# Altium schematic sheet 幻影光靈-學院-武器_20241004.SchDoc
size A3
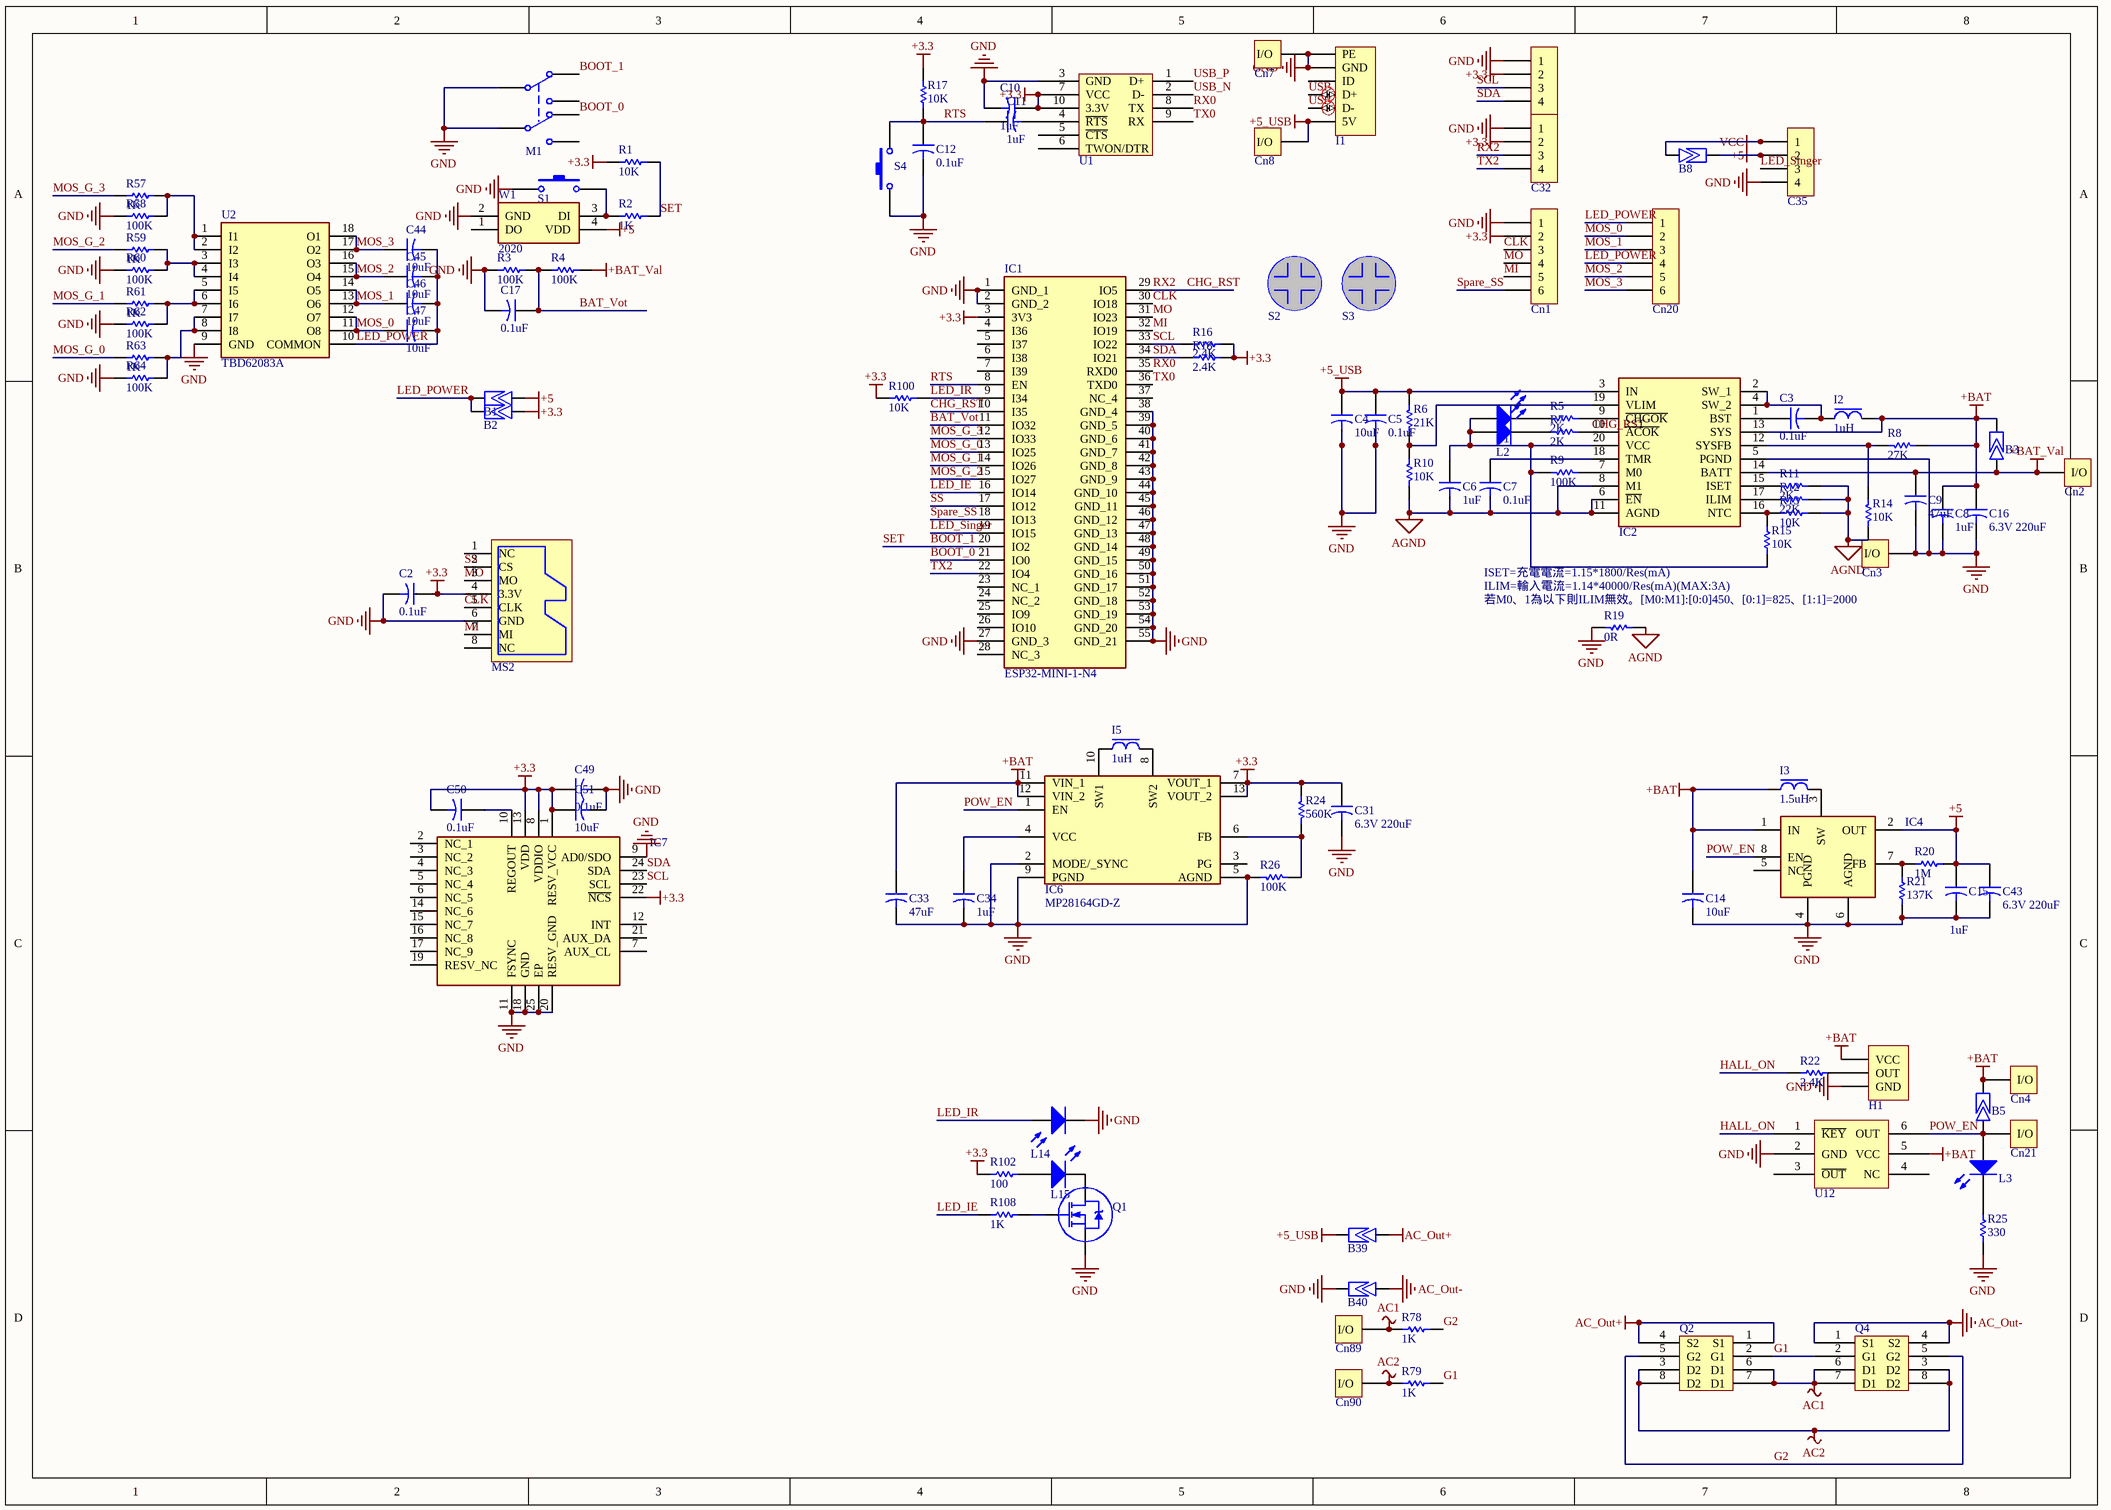
[diagram p0: 幻影光靈-學院-武器_20241004.SchDoc]

## Parts
B1  不短路  [BYPASS-0805]  (value not drawn)
B2  短路  [BYPASS-0805]  (value not drawn)
B3  不短路  [BYPASS-0805]  (value not drawn)
B5  短路  [BYPASS-0402]  (value not drawn)
B8  短路  [BYPASS-0805]  (value not drawn)
B39  短路  [BYPASS-1206]  (value not drawn)
B40  短路  [BYPASS-1206]  (value not drawn)
C1  KF2510-4  [Connector_KF2510-4A]  (value not drawn)
C2  0.1uF  [Cap-0603]
C3  0.1uF  [Cap-0603]
C4  10uF  [Cap-0603]
C5  0.1uF  [Cap-0603]
C6  1uF  [Cap-0603]
C7  0.1uF  [Cap-0603]
C8  1uF  [Cap-0603]
C9  47uF  [CAP-1210]
C10  1uF  [Cap-0603]
C11  1uF  [Cap-0603]
C12  0.1uF  [Cap-0603]
C14  10uF  [Cap-0603]
C15  1uF  [Cap-0603]
C16  6.3V 220uF  [CAP-B3528]
C17  0.1uF  [Cap-0603]
C31  6.3V 220uF  [CAP-B3528]
C32  KF2510-4  [Connector_KF2510-4A]  (value not drawn)
C33  47uF  [Cap-0603]
C34  1uF  [Cap-0603]
C35  KF2510-4  [Connector_KF2510-4A]  (value not drawn)
C43  6.3V 220uF  [CAP-B3528]
C44  10uF  [Cap-0603]
C45  10uF  [Cap-0603]
C46  10uF  [Cap-0603]
C47  10uF  [Cap-0603]
C49  0.1uF  [Cap-0603]
C50  0.1uF  [Cap-0603]
C51  10uF  [Cap-0603]
Cn1  KF2510-6  [Connector_KF2510-6A]  (value not drawn)
Cn2  Contact  [Contact_Joints1*0.5]  (value not drawn)
Cn3  Contact  [Contact_Joints1*0.5]  (value not drawn)
Cn4  Contact  [Contact_Joints1*0.5]  (value not drawn)
Cn7  Contact  [Contact_Joints1*0.5]  (value not drawn)
Cn8  Contact  [Contact_Joints1*0.5]  (value not drawn)
Cn20  KF2510-6  [Connector_KF2510-6A]  (value not drawn)
Cn21  Contact  [Contact_Joints1*0.5]  (value not drawn)
Cn89  Contact  [Contact_Joints1*0.5]  (value not drawn)
Cn90  Contact  [Contact_Joints1*0.5]  (value not drawn)
H1  A3212#不用SMT  [SOT 23-3]  (value not drawn)
I1  Interface_USB-Micro  [Interface_USB-micro]  (value not drawn)
I2  1uH  [Inductor-0630]
I3  1.5uH  [Inductor-0630]
I5  1uH  [Inductor-0630]
IC1  ESP32-MINI-1-N4  [ESP32MINI1N4]
IC2  MP2617BGL-P  [MP2617BGL]  (value not drawn)
IC4  MP3414AGJ-Z  [SOT 23-8]  (value not drawn)
IC6  MP28164GD-Z  [MP28164GDZ]
IC7  MPU-9250  [QFN-24]  (value not drawn)
L1  紅  [LED-0603]  (value not drawn)
L2  綠  [LED-0603]  (value not drawn)
L3  綠  [LED-0603]  (value not drawn)
L14  LED-IR  [LED-IR-1206]  (value not drawn)
L15  LED-IE  [LED-IE-1206]  (value not drawn)
M1  MST22D18G2  [Switch_MST22D18G2]  (value not drawn)
MS2  Interface_MicroSD card slot  [Interface_MicroSD card slot]  (value not drawn)
Q1  AO3400  [SOT 23-3]  (value not drawn)
Q2  MOS_Dual P_AON2801  [DFN-6_2x2]  (value not drawn)
Q4  MOS_Dual N_AON2800  [DFN-6_2x2]  (value not drawn)
R1  10K  [Res-0603]
R2  1K  [Res-0603]
R3  100K  [Res-0603]
R4  100K  [Res-0603]
R5  2K  [Res-0603]
R6  21K  [Res-0603]
R7  2K  [Res-0603]
R8  27K  [Res-0603]
R9  100K  [Res-0603]
R10  10K  [Res-0603]
R11  2K  [Res-0603]
R12  22K  [Res-0603]
R13  10K  [Res-0603]
R14  10K  [Res-0603]
R15  10K  [Res-0603]
R16  2.4K  [Res-0603]
R17  10K  [Res-0603]
R18  2.4K  [Res-0603]
R19  0R  [Res-0603]
R20  1M  [Res-0603]
R21  137K  [Res-0603]
R22  2.4K  [Res-0603]
R24  560K  [Res-0603]
R25  330  [Res-0603]
R26  100K  [Res-0603]
R57  1K  [Res-0603]
R58  100K  [Res-0603]
R59  1K  [Res-0603]
R60  100K  [Res-0603]
R61  1K  [Res-0603]
R62  100K  [Res-0603]
R63  1K  [Res-0603]
R64  100K  [Res-0603]
R78  1K  [Res-0603]
R79  1K  [Res-0603]
R100  10K  [Res-0603]
R102  100  [Res-0603]
R108  1K  [Res-0603]
S1  Switch  [Switch SMD-3.6*6*2.5]  (value not drawn)
S2  M3  [Screw M3]  (value not drawn)
S3  M3  [Screw M3]  (value not drawn)
S4  Switch  [Switch SMD-3.6*6*2.5]  (value not drawn)
U1  CH340X  [SSOP-10]  (value not drawn)
U2  TBD62083A  [TSSOP-18]
U12  CS2130#不用SMT  [SOT 23-6]  (value not drawn)
W1  2020  [LED-WS2812B-2020]

## Nets
+3.3: B2.2 C1.2 C2.1 C10.1 C31.1 C32.2 C49.1 C50.2 C51.1 Cn1.2 IC1.3(3V3) IC6.7(VOUT_1) IC6.13(VOUT_2) IC7.1(RESV_VCC) IC7.8(VDDIO) IC7.13(VDD) IC7.22(~{NCS}) MS2.4(3.3V) R1.1 R16.1 R17.1 R18.2 R24.2 R100.1 R102.1 U1.7(VCC) U1.10(3.3V)
+5: B1.2 B8.1 C15.1 C35.2 C43.1 IC4.2(OUT) R20.1 W1.4(VDD)
+5_USB: B39.1 C4.1 C5.1 Cn8.1(I/O) I1.1(5V) IC2.3(IN) R6.1
+BAT: B3.1 B5.1 C8.1 C14.1 C16.1 C33.1 Cn4.1(I/O) H1.1(VCC) I2.2 I3.1 IC2.13(SYS) IC4.1(IN) IC6.11(VIN_1) IC6.12(VIN_2) R8.2 U12.5(VCC)
+BAT_Val: B3.2 C9.1 Cn2.1(I/O) IC2.14(BATT) R4.2
AC1: Cn89.1(I/O) Q2.6(D1) Q2.7(D1) Q4.6(D1) Q4.7(D1) R78.2
AC2: Cn90.1(I/O) Q2.3(D2) Q2.8(D2) Q4.3(D2) Q4.8(D2) R79.2
AC_Out+: B39.2 Q2.1(S1) Q2.4(S2)
AC_Out-: B40.2 Q4.1(S1) Q4.4(S2)
AGND: C6.2 C7.2 IC2.6(~{EN}) IC2.8(M1) IC2.11(AGND) R10.2 R11.2 R12.2 R13.2 R14.2 R19.2
GND: B40.1 C1.1 C2.2 C4.2 C5.2 C8.2 C9.2 C10.2 C12.2 C14.2 C15.2 C16.2 C17.2 C31.2 C32.1 C33.2 C34.2 C35.4 C43.2 C49.2 C51.2 Cn1.1 Cn3.1(I/O) Cn7.1(I/O) H1.3(GND) I1.5(GND) I1.PE IC1.1(GND_1) IC1.2(GND_2) IC1.27(GND_3) IC1.38(GND_4) IC1.39(GND_5) IC1.40(GND_6) IC1.41(GND_7) IC1.42(GND_8) IC1.43(GND_9) IC1.44(GND_10) IC1.45(GND_11) IC1.46(GND_12) IC1.47(GND_13) IC1.48(GND_14) IC1.49(GND_15) IC1.50(GND_16) IC1.51(GND_17) IC1.52(GND_18) IC1.53(GND_19) IC1.54(GND_20) IC1.55(GND_21) IC2.5(PGND) IC4.4(PGND) IC4.6(AGND) IC6.2(MODE/_SYNC) IC6.5(AGND) IC6.9(PGND) IC7.9(AD0/SDO) IC7.11(FSYNC) IC7.18(GND) IC7.20(RESV_GND) IC7.25(EP) L14.2(K) M1.1 M1.4 MS2.6(GND) Q1.2(S) R3.1 R19.1 R21.1 R25.1 R26.1 R58.1 R60.1 R62.1 R64.1 S1.1 S4.2 U1.3(GND) U2.9(GND) U12.2(GND) W1.2(GND)
VCC: B8.2 C35.1
BAT_Vot: C17.1 IC1.11(IO32) R3.2 R4.1
BOOT_0: IC1.21(IO0) M1.5
BOOT_1: IC1.20(IO2) M1.2 R1.2 R2.2  [also labelled SET]
CHG_RST: C32.3 IC1.10(I35) IC1.29(IO5) IC2.10(~{ACOK}) R7.2  [also labelled RX2]
CLK: Cn1.3 IC1.30(IO18) MS2.5(CLK)
G1: Q2.2(G1) Q4.2(G1) R79.1
G2: Q2.5(G2) Q4.5(G2) R78.1
HALL_ON: R22.1 U12.1(~{KEY})
LED_IE: IC1.16(IO14) R108.1
LED_IR: IC1.9(I34) L14.1(A) R100.2
LED_POWER: B1.1 B2.1 C44.2 C45.2 C46.2 C47.2 Cn20.1 Cn20.4 U2.10(COMMON)
LED_Singer: C35.3 IC1.19(IO15)
MI: Cn1.5 IC1.32(IO19) MS2.7(MI)
MO: Cn1.4 IC1.31(IO23) MS2.3(MO)
MOS_0: C47.1 Cn20.2 U2.11(O8) U2.12(O7)
MOS_1: C46.1 Cn20.3 U2.13(O6) U2.14(O5)
MOS_2: C45.1 Cn20.5 U2.15(O4) U2.16(O3)
MOS_3: C44.1 Cn20.6 U2.17(O2) U2.18(O1)
MOS_G_0: IC1.13(IO25) R63.1
MOS_G_1: IC1.14(IO26) R61.1
MOS_G_2: IC1.15(IO27) R59.1
MOS_G_3: IC1.12(IO33) R57.1
POW_EN: B5.2 Cn21.1(I/O) IC4.8(EN) IC6.1(EN) L3.2(A) U12.6(OUT)
RTS: C11.1 C12.1 IC1.8(EN) R17.2 S4.1
RX0: IC1.35(RXD0) U1.8(TX)
SCL: C1.3 IC1.33(IO22) IC7.23(SCL) R16.2
SDA: C1.4 IC1.34(IO21) IC7.24(SDA) R18.1
Spare_SS: Cn1.6 IC1.18(IO13)
SS: IC1.17(IO12) MS2.2(CS)
TX0: IC1.36(TXD0) U1.9(RX)
TX2: C32.4 IC1.22(IO4)
USB_N: I1.2(D-) U1.2(D-)
USB_P: I1.3(D+) U1.1(D+)
NetC3_1: C3.1 IC2.1(BST)
NetC3_2: C3.2 I2.1 IC2.2(SW_1) IC2.4(SW_2)
NetC6_1: C6.1 IC2.20(VCC) L1.2(A) L2.2(A) R9.1 R15.1
NetC7_1: C7.1 IC2.18(TMR)
NetC11_2: C11.2 U1.4(~{RTS})
NetC34_1: C34.1 IC6.4(VCC)
NetC50_1: C50.1 IC7.10(REGOUT)
NetH1_2: H1.2(OUT) R22.2
NetI3_2: I3.2 IC4.3(SW)
NetI5_1: I5.1 IC6.8(SW2)
NetI5_2: I5.2 IC6.10(SW1)
NetIC2_7: IC2.7(M0) R9.2
NetIC2_9: IC2.9(~{CHGOK}) R5.2
NetIC2_12: IC2.12(SYSFB) R8.1 R14.1
NetIC2_15: IC2.15(ISET) R11.1
NetIC2_16: IC2.16(NTC) R13.1 R15.2
NetIC2_17: IC2.17(ILIM) R12.1
NetIC2_19: IC2.19(VLIM) R6.2 R10.1
NetIC4_7: IC4.7(FB) R20.2 R21.2
NetIC6_6: IC6.6(FB) R24.1 R26.2
NetL1_1: L1.1(K) R5.1
NetL2_1: L2.1(K) R7.1
NetL3_1: L3.1(K) R25.2
NetL15_1: L15.1(K) Q1.3(D)
NetL15_2: L15.2(A) R102.2
NetQ1_1: Q1.1(G) R108.2
NetR2_1: R2.1 S1.2 W1.3(DI)
NetR57_2: R57.2 R58.2 U2.1(I1) U2.2(I2)
NetR59_2: R59.2 R60.2 U2.3(I3) U2.4(I4)
NetR61_2: R61.2 R62.2 U2.5(I5) U2.6(I6)
NetR63_2: R63.2 R64.2 U2.7(I7) U2.8(I8)

Not connected (* = marked no-connect by the designer): I1 4(ID); IC1 4(I36) 5(I37) 6(I38) 7(I39) 23(NC_1) 24(NC_2) 25(IO9) 26(IO10) 28(NC_3) 37(NC_4); IC4 5(NC); IC6 3(PG); IC7 2(NC_1) 3(NC_2) 4(NC_3) 5(NC_4) 6(NC_5) 7(AUX_CL) 12(INT) 14(NC_6) 15(NC_7) 16(NC_8) 17(NC_9) 19(RESV_NC) 21(AUX_DA); M1 3 6; MS2 1(NC) 8(NC); U1 5(~{CTS}) 6(TWON/DTR); U12 3(~{OUT}) 4(NC); W1 1(DO)

## Layout directives
differential pair: USB_N, USB_P

## Notes on the sheet
- ISET=充電電流=1.15*1800/Res(mA)
- (near R19) ILIM=輸入電流=1.14*40000/Res(mA)(MAX:3A)
- (near R19) 若M0、1為以下則ILIM無效。[M0:M1]:[0:0]450、[0:1]=825、[1:1]=2000

## Library data of the parts
B1-B3 B5 B8 B39 B40 = Bypass: 短路焊點(如標註短路則需額外補錫使其短路)
C1 C32 C35 = Contact(4P): 接線端子
C2-C12 C14-C17 C31 C33 C34 C43-C47 C49-C51 = Cap: 電容
  C9 C16 C17 C31 C43-C47 C49-C51: ComponentLink1Description: datasheet; ComponentLink1URL: https://product.tdk.com/system/files/dam/doc/product/capacitor/ceramic/mlcc/catalog/mlcc_commercial_general_en.pdf
  C14: ComponentLink1Description: datasheet; ComponentLink1URL: chrome-extension://efaidnbmnnnibpcajpcglclefindmkaj/https://product.tdk.com/system/files/dam/doc/product/capacitor/ceramic/mlcc/catalog/mlcc_commercial_general_en.pdf
Cn1 Cn20 = Contact(6P): 接線端子
Cn2-Cn4 Cn7 Cn8 Cn21 Cn89 Cn90 = Contact: 接線端子、接點、郵票孔(非焊接元件)
H1 = Sensor_Hall: 感測器_霍爾
I1 = Interface_USB-Micro: 接頭_USB-Micro
I2 I3 = Inductor: 電感
I5 = Inductor: 一體成型電感
IC1 = ESP32-MINI-1-N4: Integrated Circuit; Manufacturer_Name: Espressif Systems; Datasheet Link: https://www.mouser.ca/datasheet/2/891/Espressif_Systems_04082021_ESP32_MINI_1-2295906.pdf; Height: 2.55mm; Manufacturer_Part_Number: ESP32-MINI-1-N4; Mouser Part Number: 356-ESP32-MINI1PH3Q0; Mouser Price/Stock: https://www.mouser.co.uk/ProductDetail/Espressif-Systems/ESP32-MINI-1-N4?qs=DRkmTr78QAQ4lzAXUvxJJw%3D%3D
IC2 = MP2617BGL-P: 單節鋰電池管理IC / M0:0、M1:0=輸入限流500ma / M0:0、M1:1=輸入限流900ma / M0:1、M1:0=根據ILIM / M0:NC、M1:NC=輸入限流2A / ILIM公式=1.14*40000/R，23K約2A / ISET公式=1.15*1800/R,1.05K約2A; Manufacturer_Name: Monolithic Power Systems (MPS); Datasheet Link: https://www.monolithicpower.com/pub/media/document/m/p/mp2617a_mp2617b_r1.23_2.pdf; Height: 1.05mm; Manufacturer_Part_Number: MP2617BGL-P; Mouser Part Number: 946-MP2617BGL-P; Mouser Price/Stock: https://www.mouser.co.uk/ProductDetail/Monolithic-Power-Systems-MPS/MP2617BGL-P?qs=IW9Tsl75qsVicCXRSj7%2FvQ%3D%3D; Parameter 1: M0:0、M1:0=輸入限流500ma
IC4 = MP3414DJ-LF-Z: 同步升压IC; Manufacturer_Name: Monolithic Power Systems (MPS); Datasheet Link: https://www.monolithicpower.com/en/documentview/productdocument/index/version/2/document_type/Datasheet/lang/en/sku/MP3414/document_id/1153/; Height: 1mm; Manufacturer_Part_Number: MP3414DJ-LF-Z; Mouser Part Number: 946-MP3414DJLFZ; Mouser Price/Stock: https://www.mouser.co.uk/ProductDetail/Monolithic-Power-Systems-MPS/MP3414DJ-LF-Z?qs=Pyu0ZBy%2FIJZOKilm4e4DTw%3D%3D; ComponentLink1Description: datasheet; ComponentLink1URL: https://www.monolithicpower.cn/cn/documentview/productdocument/index/version/2/document_type/Datasheet/lang/en/sku/MP3414AGJ-Z/document_id/1172/
IC6 = MP28164GD-Z: 升降壓IC 2.5~5.5 to 1.5~5; Manufacturer_Name: Monolithic Power Systems (MPS); Datasheet Link: https://www.monolithicpower.com/DesktopModules/DocumentManage/API/Document/GetDocument?id=4470; Height: 1mm; Manufacturer_Part_Number: MP28164GD-Z; Mouser Part Number: 946-MP28164GD-Z; Mouser Price/Stock: https://www.mouser.co.uk/ProductDetail/Monolithic-Power-Systems-MPS/MP28164GD-Z?qs=cslStgdnz9MCzqiB1I8TOA%3D%3D; ComponentLink1Description: datasheet; ComponentLink1URL: https://www.mouser.tw/datasheet/2/277/MP28164GD_Z-2945709.pdf
IC7 = MPU-9250: I2C,SPI,9軸陀螺儀; Manufacturer_Name: TDK; Datasheet Link: https://media.digikey.com/pdf/Data%20Sheets/TDK%20PDFs/MPU-9250_Rev_1.1.pdf; Height: 1.05mm; Manufacturer_Part_Number: MPU-9250; Mouser Part Number: 410-MPU-9250; Mouser Price/Stock: https://www.mouser.co.uk/ProductDetail/TDK-InvenSense/MPU-9250?qs=u4fy%2FsgLU9OhGjFkQSZssA%3D%3D
L1-L3 = LED
L14 = LED-IR: LED,紅外線接收
L15 = LED: LED,,紅外線發射
M1 = Switch_Slide_2: 開關_滑動_2通道
MS2 = Interface_MicroSD card slot: Micro SD 卡座
Q1 = MOS-N: 場效電晶體_N
Q2 = MOS_Dual P_AON2801: MOS,雙PMOS; ComponentLink1Description: AON2801; ComponentLink1URL: https://aosmd.com/res/data_sheets/AON2801.pdf; ComponentLink2Description: AON2803; ComponentLink2URL: http://aosmd.com/pdfs/datasheet/AON2803.pdf; ComponentLink3Description: AON2809; ComponentLink3URL: https://static6.arrow.com/aropdfconversion/c15bcf60c1d0cbaad3e71569b3bcaeca466ad052/aon2809.pdf
Q4 = MOS_Dual N_AON2800: MOS,雙NMOS; ComponentLink1Description: AON2800; ComponentLink1URL: https://pese.oss-cn-shenzhen.aliyuncs.com/pdfs/Alpha-Omega-Semicon-AOS-AON2800_C125870.pdf; ComponentLink2Description: AON2802; ComponentLink2URL: https://aosmd.com/sites/default/files/res/datasheets/AON2802.pdf; ComponentLink3Description: AON2812; ComponentLink3URL: https://aosmd.com/res/data_sheets/AON2812.pdf; ComponentLink4Description: AON2810; ComponentLink4URL: https://aosmd.com/res/data_sheets/AON2810.pdf
R1-R22 R24-R26 R57-R64 R78 R79 R100 R102 R108 = Res: 電阻
S1 S4 = Switch: 開關_按鍵
S2 S3 = Screw: 螺絲(非焊接元件)
U1 = CH340X: USB轉TTL芯片; ComponentLink1Description: datasheet; ComponentLink1URL: https://datasheet.lcsc.com/szlcsc/2008191806_WCH-Jiangsu-Qin-Heng-CH340G_C14267.pdf; Parameter 1: *
U2 = TBD62083A: 閘極驅動器 P型 50V 0.5A; Manufacturer_Name: Toshiba; Manufacturer_Part_Number: TBD62083AFNG,EL; Geometry.Height: 1.55mm; Mouser Part Number: 757-TBD60183AFNGEL; Mouser Price/Stock: https://www.mouser.co.uk/ProductDetail/Toshiba/TBD62183AFNGEL?qs=lYGu3FyN48dJ%2FQ%2FqZoTqjQ%3D%3D; Datasheet Link: chrome-extension://efaidnbmnnnibpcajpcglclefindmkaj/https://www.mouser.tw/datasheet/2/408/TBD62083AFWG_datasheet_en_20160511-769679.pdf; ComponentLink1Description: datasheet; ComponentLink1URL: https://www.mouser.tw/datasheet/2/408/TBD62083AFNG_datasheet_en_20160511-769697.pdf
U12 = CS2130: 單鍵ON/OFF芯片; ComponentLink1Description: datasheet; ComponentLink1URL: http://www.szecm.com/Products/cs2130djkg.html
W1 = WS2812B: LED幻彩燈珠; Manufacturer_Name: Adafruit; Manufacturer_Part_Number: 4684; Datasheet Link: https://cdn-shop.adafruit.com/product-files/4684/4684_WS2812B-2020_V1.3_EN.pdf; Height: 0.84mm; Mouser Part Number: 485-4684; Mouser Price/Stock: https://www.mouser.co.uk/ProductDetail/Adafruit/4684?qs=DPoM0jnrROWIv9%2FMCIm5vw%3D%3D; Arrow Part Number: 4684; Arrow Price/Stock: https://www.arrow.com/en/products/4684/adafruit-industries?region=nac